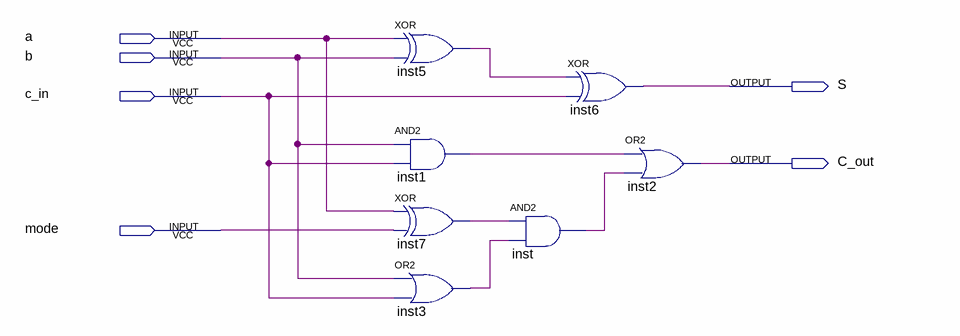
[diagram p0: schematic sheet]
// Quartus schematic somador_e_subtrator.bdf as structural Verilog: 7 symbols, 6 pins
module somador_e_subtrator (
  input  a,
  input  b,
  input  c_in,
  input  mode,
  output S,
  output C_out
);

  wire inst1_out, inst3_out, inst5_out, inst7_out, inst_out;

  xor inst5 (inst5_out, a, b);
  and inst1 (inst1_out, b, c_in);
  xor inst7 (inst7_out, a, mode);
  or inst3 (inst3_out, b, c_in);
  and inst (inst_out, inst7_out, inst3_out);
  xor inst6 (S, inst5_out, c_in);
  or inst2 (C_out, inst1_out, inst_out);
endmodule
